# EAGLE schematic tableau (EAGLE 8.4.3)
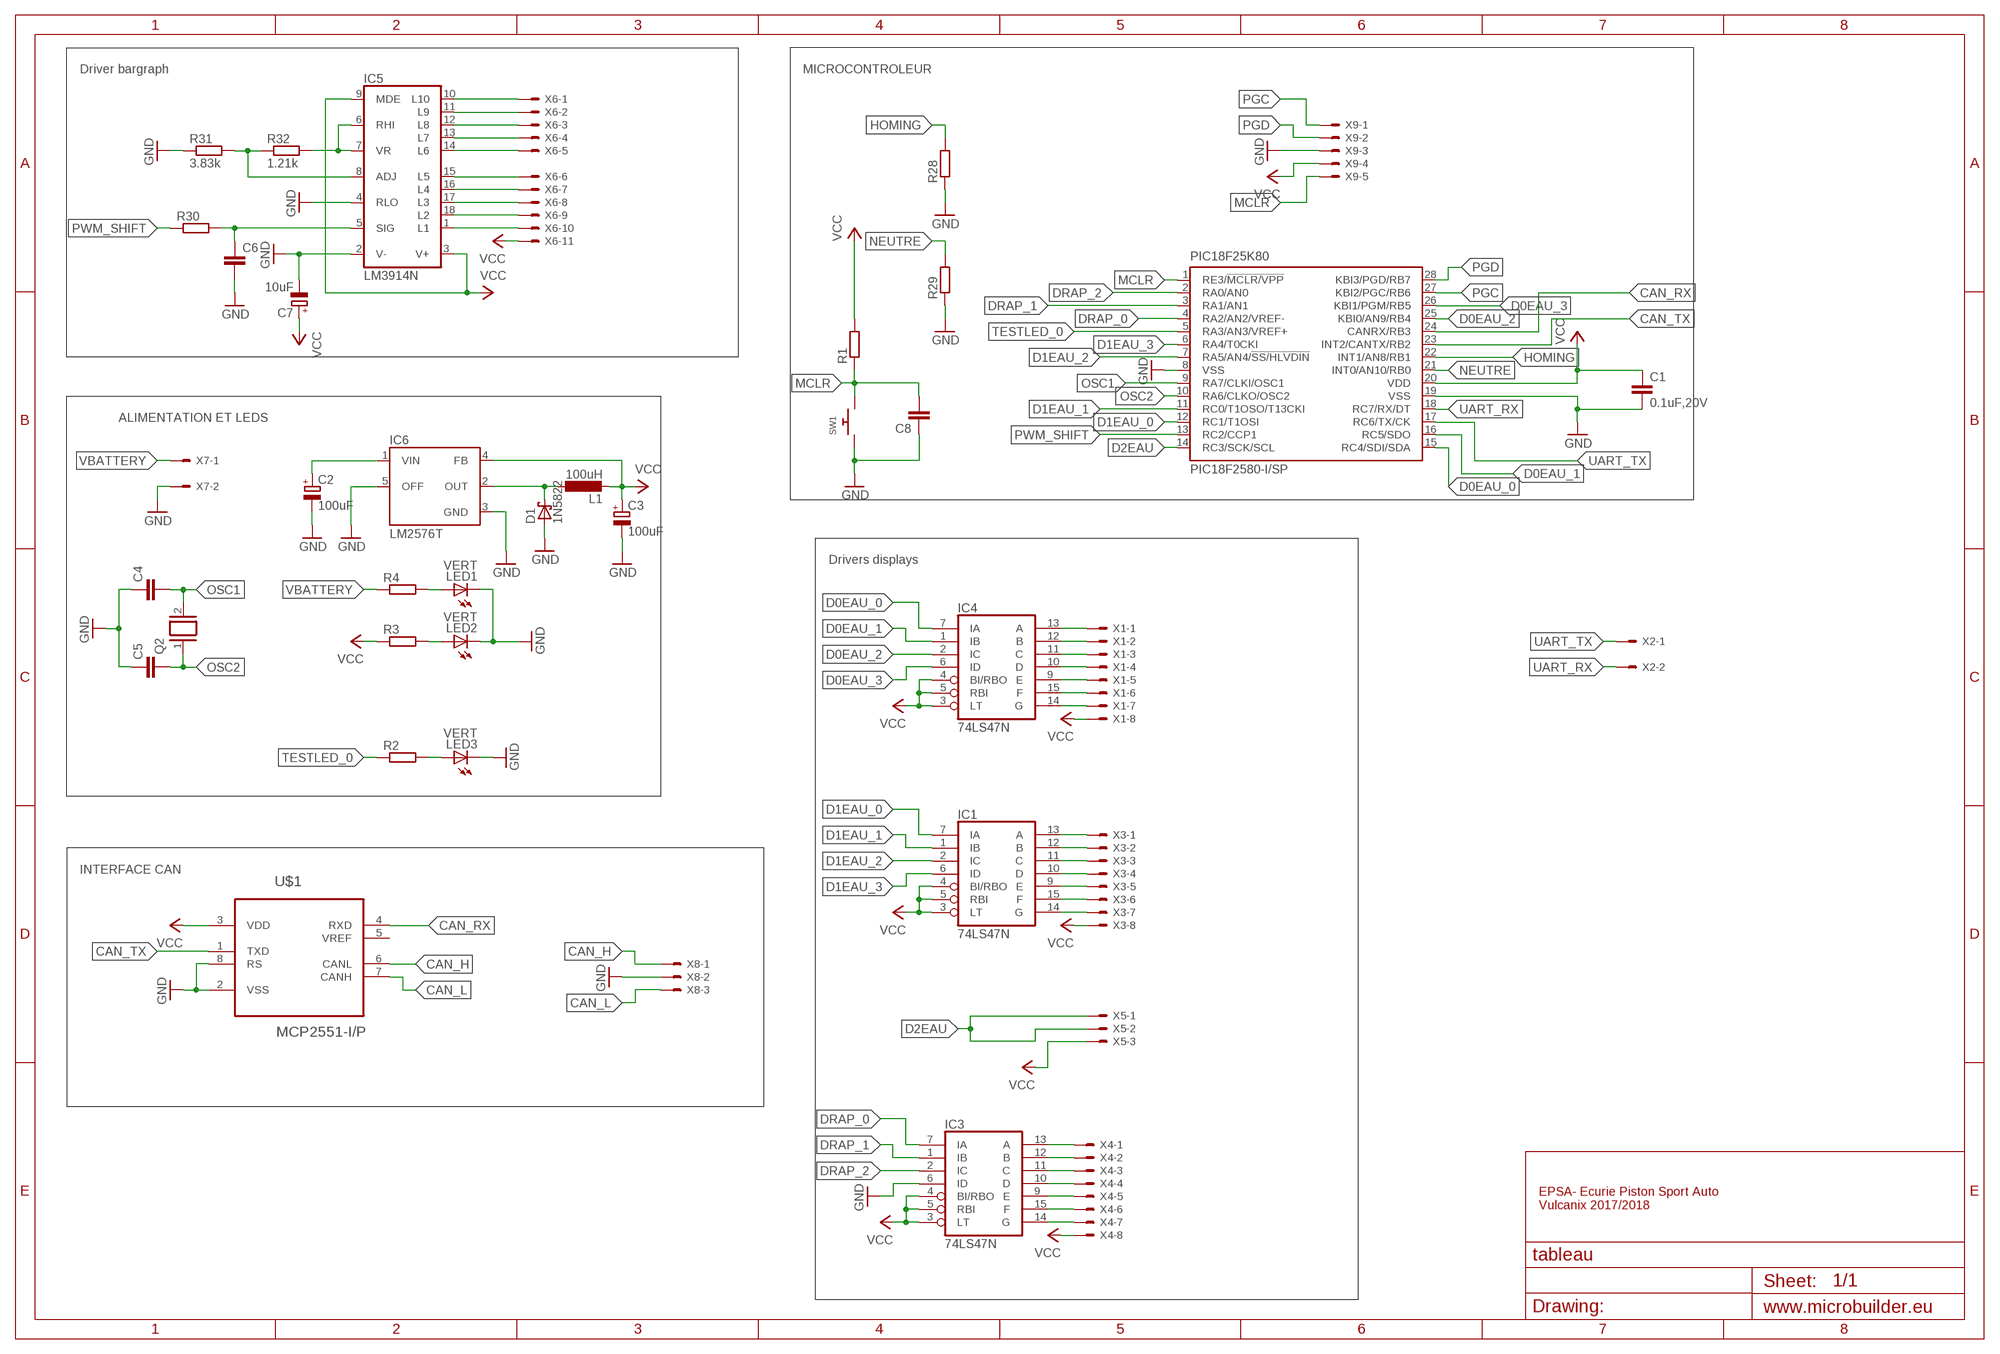
[diagram p0: schematic, sheet 1]

## Parts
C1  0.1uF,20V  C-EU025-025X050  [C025-025X050]
C2  100uF  CPOL-EUE2-5  [E2-5]
C3  100uF  CPOL-EUE2-5  [E2-5]
C4  C-EU025-030X050  [C025-030X050]
C5  C-EU025-030X050  [C025-030X050]
C6  C-EU025-025X050  [C025-025X050]
C7  10uF  CPOL-EUE2-5  [E2-5]
C8  C-EU025-030X050  [C025-030X050]
D1  1N5822  SCHOTTKY-DIODEDO201T15  [DO201T15]
IC1  74LS47N  [DIL16]
IC3  74LS47N  [DIL16]
IC4  74LS47N  [DIL16]
IC5  LM3914N  [DIL18]
IC6  LM2576T  [TO220-5]
L1  100uH  L-EU0207/10  [0207/10]
LED1  VERT  LED3MM  [LED3MM]
LED2  VERT  LED3MM  [LED3MM]
LED3  VERT  LED3MM  [LED3MM]
PIC18F25K80  PIC18F2580-I/SP  [DIL28-3]
Q2  XTAL/S  [QS]
R1  R-EU_0204/7  [0204/7]
R2  R-EU_0204/7  [0204/7]
R3  R-EU_0204/7  [0204/7]
R4  R-EU_0204/7  [0204/7]
R28  R-EU_0204/7  [0204/7]
R29  R-EU_0204/7  [0204/7]
R30  R-EU_0204/7  [0204/7]
R31  3.83k  R-EU_0204/7  [0204/7]
R32  1.21k  R-EU_0204/7  [0204/7]
SW1  SWITCH_PUSHBUTTONSOFTTOUCHSMD_SJ  [PUSHBUTTON_SMD_SJ]
U$1  MCP2551-I/P  [DIP254P762X432-8]
X1  KK-156-8  [KK-156-8]
X2  KK-156-2  [KK-156-2]
X3  KK-156-8  [KK-156-8]
X4  KK-156-8  [KK-156-8]
X5  KK-156-3  [KK-156-3]
X6  KK-156-11  [KK-156-11]
X7  KK-156-2  [KK-156-2]
X8  KK-156-3  [KK-156-3]
X9  KK-156-5  [KK-156-5]

## Nets
CAN_H: U$1.6(CANL) X8.1
CAN_L: U$1.7(CANH) X8.3
CAN_RX: PIC18F25K80.24(CANRX/RB3) U$1.4(RXD)
CAN_TX: PIC18F25K80.23(INT2/CANTX/RB2) U$1.1(TXD)
D0EAU_0: IC4.7(IA) PIC18F25K80.15(RC4/SDI/SDA)
D0EAU_1: IC4.1(IB) PIC18F25K80.16(RC5/SDO)
D0EAU_2: IC4.2(IC) PIC18F25K80.25(KBI0/AN9/RB4)
D0EAU_3: IC4.6(ID) PIC18F25K80.26(KBI1/PGM/RB5)
D1EAU_0: IC1.7(IA) PIC18F25K80.12(RC1/T1OSI)
D1EAU_1: IC1.1(IB) PIC18F25K80.11(RC0/T1OSO/T13CKI)
D1EAU_2: IC1.2(IC) PIC18F25K80.7(RA5/AN4/!SS/HLVDIN)
D1EAU_3: IC1.6(ID) PIC18F25K80.6(RA4/T0CKI)
D2EAU: PIC18F25K80.14(RC3/SCK/SCL) X5.1 X5.2
DRAP_0: IC3.7(IA) PIC18F25K80.4(RA2/AN2/VREF-)
DRAP_1: IC3.1(IB) PIC18F25K80.3(RA1/AN1)
DRAP_2: IC3.2(IC) PIC18F25K80.2(RA0/AN0)
GND: C1.2 C2.- C3.- C4.1 C5.1 C6.2 C7.- C8.1 D1.A IC3.6(ID) IC5.2(V-) IC5.4(RLO) IC6.3(GND) IC6.5(OFF) LED1.K(C) LED2.K(C) LED3.K(C) PIC18F25K80.8(VSS) PIC18F25K80.19(VSS) R28.1 R29.1 R31.1 SW1.P$1 U$1.2(VSS) U$1.8(RS) X7.2 X8.2 X9.3
HOMING: PIC18F25K80.22(INT1/AN8/RB1) R28.2
MCLR: C8.2 PIC18F25K80.1(RE3/!MCLR/VPP) R1.1 SW1.P$2 X9.5
N$1: LED1.A R4.2
N$2: IC4.13(A) X1.1
N$3: LED2.A R3.2
N$6: IC4.12(B) X1.2
N$7: IC4.11(C) X1.3
N$8: IC4.10(D) X1.4
N$9: IC4.9(E) X1.5
N$10: IC4.15(F) X1.6
N$11: IC4.14(G) X1.7
N$12: IC1.13(A) X3.1
N$13: IC1.12(B) X3.2
N$14: IC1.11(C) X3.3
N$15: IC1.10(D) X3.4
N$16: IC1.9(E) X3.5
N$17: IC1.15(F) X3.6
N$18: IC1.14(G) X3.7
N$19: IC3.13(A) X4.1
N$20: IC3.12(B) X4.2
N$21: IC3.11(C) X4.3
N$22: C2.+ IC6.1(VIN)
N$23: IC3.10(D) X4.4
N$24: IC3.9(E) X4.5
N$25: IC3.15(F) X4.6
N$26: IC3.14(G) X4.7
N$27: IC5.10(L10) X6.1
N$28: IC5.11(L9) X6.2
N$29: IC5.12(L8) X6.3
N$30: IC5.13(L7) X6.4
N$31: IC5.14(L6) X6.5
N$32: IC5.15(L5) X6.6
N$33: IC5.16(L4) X6.7
N$34: IC5.17(L3) X6.8
N$35: IC5.18(L2) X6.9
N$36: IC5.1(L1) X6.10
N$58: LED3.A R2.2
N$59: C6.1 IC5.5(SIG) R30.2
N$60: IC5.6(RHI) IC5.7(VR) R32.2
N$61: IC5.8(ADJ) R31.2 R32.1
N$62: D1.C IC6.2(OUT) L1.1
NEUTRE: PIC18F25K80.21(INT0/AN10/RB0) R29.2
OSC1: C4.2 PIC18F25K80.9(RA7/CLKI/OSC1) Q2.2
OSC2: C5.2 PIC18F25K80.10(RA6/CLKO/OSC2) Q2.1
PGC: PIC18F25K80.27(KBI2/PGC/RB6) X9.1
PGD: PIC18F25K80.28(KBI3/PGD/RB7) X9.2
PWM_SHIFT: PIC18F25K80.13(RC2/CCP1) R30.1
TESTLED_0: PIC18F25K80.5(RA3/AN3/VREF+) R2.1
UART_RX: PIC18F25K80.18(RC7/RX/DT) X2.2
UART_TX: PIC18F25K80.17(RC6/TX/CK) X2.1
VBATTERY: R4.1 X7.1
VCC: C1.1 C3.+ C7.+ IC1.3(LT) IC1.4(BI/RBO) IC1.5(RBI) IC3.3(LT) IC3.4(BI/RBO) IC3.5(RBI) IC4.3(LT) IC4.4(BI/RBO) IC4.5(RBI) IC5.3(V+) IC5.9(MDE) IC6.4(FB) L1.2 PIC18F25K80.20(VDD) R1.2 R3.1 U$1.3(VDD) X1.8 X3.8 X4.8 X5.3 X6.11 X9.4
Unconnected: U$1.5(VREF)

## Notes on the sheet
- Driver bargraph | MICROCONTROLEUR
- ALIMENTATION ET LEDS
- Drivers displays
- INTERFACE CAN
- EPSA- Ecurie Piston Sport Auto
  Vulcanix 2017/2018

## Power pins joined to a net without a drawn wire
GND: IC1.8(GND) IC3.8(GND) IC4.8(GND)
VCC: IC1.16(VCC) IC3.16(VCC) IC4.16(VCC)

## Library data of the parts
C1 C4 C5 C8 = rcl:C-EU: CAPACITOR, European symbol
C2 C3 C7 = rcl:CPOL-EU: POLARIZED CAPACITOR, European symbol
C6 = resistor:C-EU: CAPACITOR, European symbol
D1 = diode:SCHOTTKY-DIODE: Schottky Diode
IC1 IC3 IC4 = 74xx-eu:74*47: BCD to seven segment DECODER/DRIVER Source: http://www.ee.washington.edu/stores/DataSheets/74ls/74ls47.pdf
IC5 = linear:LM3914N: LED DRIVER senses analog voltage levels and drives 10 LEDs
IC6 = v-reg-3:LM2576: National Semiconductor <http://www.national.com> 3.0A "Simple Switcher"(c) 52kHz, Vout 1.23-37V (HV: 57V), Vin 40V (HV: 60V), 50µA standby current
L1 = rcl:L-EU: INDUCTOR, European symbol
LED1-LED3 = led:LED: LED OSRAM: - CHIPLED LG R971, LG N971, LY N971, LG Q971, LY Q971, LO R971, LY R971 LH N974, LH R974 LS Q976, LO Q976, LY Q976 LO Q996 - Hyper CHIPLED LW Q18S LB Q993, LB Q99A, LB R99A - SideLED LS A670, LO A670, LY A670, LG A670, LP A670 LB A673, LV A673, LT A673, LW A673 LH A674 LY A675 LS A676, LA A676, LO A676, LY A676, LW A676 LS A679, LY A679, LG A679 - Hyper Micro SIDELED® LS Y876, LA Y876, LO Y876, LY Y876 LT Y87S - SmartLED LW L88C, LW L88S LB L89C, LB L89S, LG L890 LS L89K, LO L89K, LY L89K LS L896, LA L896, LO L896, LY L896 - TOPLED LS T670, LO T670, LY T670, LG T670, LP T670 LSG T670, LSP T670, LSY T670, LOP T670, LYG T670 LG T671, LOG T671, LSG T671 LB T673, LV T673, LT T673, LW T673 LH T674 LS T676, LA T676, LO T676, LY T676, LB T676, LH T676, LSB T676, LW T676 LB T67C, LV T67C, LT T67C, LS T67K, LO T67K, LY T67K, LW E67C LS E67B, LA E67B, LO E67B, LY E67B, LB E67C, LV E67C, LT E67C LW T67C LS T679, LY T679, LG T679 LS T770, LO T770, LY T770, LG T770, LP T770 LB T773, LV T773, LT T773, LW T773 LH T774 LS E675, LA E675, LY E675, LS T675 LS T776, LA T776, LO T776, LY T776, LB T776 LHGB T686 LT T68C, LB T68C - Hyper Mini TOPLED® LB M676 - Mini TOPLED Santana® LG M470 LS M47K, LO M47K, LY M47K Source: http://www.osram.convergy.de LUXEON: - LUMILED® LXK2-PW12-R00, LXK2-PW12-S00, LXK2-PW14-U00, LXK2-PW14-V00 LXK2-PM12-R00, LXK2-PM12-S00, LXK2-PM14-U00 LXK2-PE12-Q00, LXK2-PE12-R00, LXK2-PE12-S00, LXK2-PE14-T00, LXK2-PE14-U00 LXK2-PB12-K00, LXK2-PB12-L00, LXK2-PB12-M00, LXK2-PB14-N00, LXK2-PB14-P00, LXK2-PB14-Q00 LXK2-PR12-L00, LXK2-PR12-M00, LXK2-PR14-Q00, LXK2-PR14-R00 LXK2-PD12-Q00, LXK2-PD12-R00, LXK2-PD12-S00 LXK2-PH12-R00, LXK2-PH12-S00 LXK2-PL12-P00, LXK2-PL12-Q00, LXK2-PL12-R00 Source: www.luxeon.com KINGBRIGHT: KA-3528ASYC Source: www.kingbright.com
PIC18F25K80 = microchip:PIC18F2*80: 28-Pin Enhanced Flash Microcontrollers with ECAN(TM) Technology 10-Bit A/D and nanoWatt Technology Source: http://www.microchip.com .. 39637a.pdf; MF: MICROCHIP; MPN: PIC18F2580-I/SP; OC_FARNELL: 9321276; OC_NEWARK: 71J7244
Q2 = special:XTAL/S: CRYSTAL
R1-R4 R28-R32 = resistor:R-EU_: RESISTOR, European symbol
SW1 = microbuilder:SWITCH_PUSHBUTTON: Buttons SOFTTOUCHSMD_SJ - Soft touch temporary push button (Super Junk Akihabara) Compatible with SKPMANE010 [Mouser: 688-SKPMAN]
U$1 = mcp2551:MCP2551-I/P: High-Speed CAN Transceiver; DESCRIPTION: CAN CTRL; MPN: MCP2551-I/P; OC_FARNELL: 1292240; OC_NEWARK: 61K2947; PACKAGE: PDIP-8; SUPPLIER: Microchip
X1 X3 X4 = con-molex:KK-156-8: KK 156 HEADER Source: http://www.molex.com/pdm_docs/sd/026604100_sd.pdf; OC_FARNELL: unknown; OC_NEWARK: unknown
X2 X7 = con-molex:KK-156-2: KK 156 HEADER Source: http://www.molex.com/pdm_docs/sd/026604100_sd.pdf; OC_FARNELL: unknown; OC_NEWARK: unknown
X5 X8 = con-molex:KK-156-3: KK 156 HEADER Source: http://www.molex.com/pdm_docs/sd/026604100_sd.pdf; OC_FARNELL: unknown; OC_NEWARK: unknown
X6 = con-molex:KK-156-11: KK 156 HEADER Source: http://www.molex.com/pdm_docs/sd/026604100_sd.pdf; OC_FARNELL: unknown; OC_NEWARK: unknown
X9 = con-molex:KK-156-5: KK 156 HEADER Source: http://www.molex.com/pdm_docs/sd/026604100_sd.pdf; OC_FARNELL: unknown; OC_NEWARK: unknown